# Altium schematic sheet MezzanineConnectors.SchDoc
size 420 x 297 mm; DocumentNumber: 6; SheetNumber: 5; SheetTotal: 6; PageSetup: Record=PageOptions|CenterHorizontal=True|CenterVertical=True|PrintScale=0.96|XCorrection=1.00|YCorrection=1.00|PrintKind=1|BorderSize=5000000|LeftOffset=0|BottomOffset=0|Orientation=2|PaperLength=4318|PaperWidth=2794|Scale=100|PaperSource=7|PrintQuality=600|MediaType=1|DitherType=10|PaperKind=11" x 17"|PrintScaleMode=1
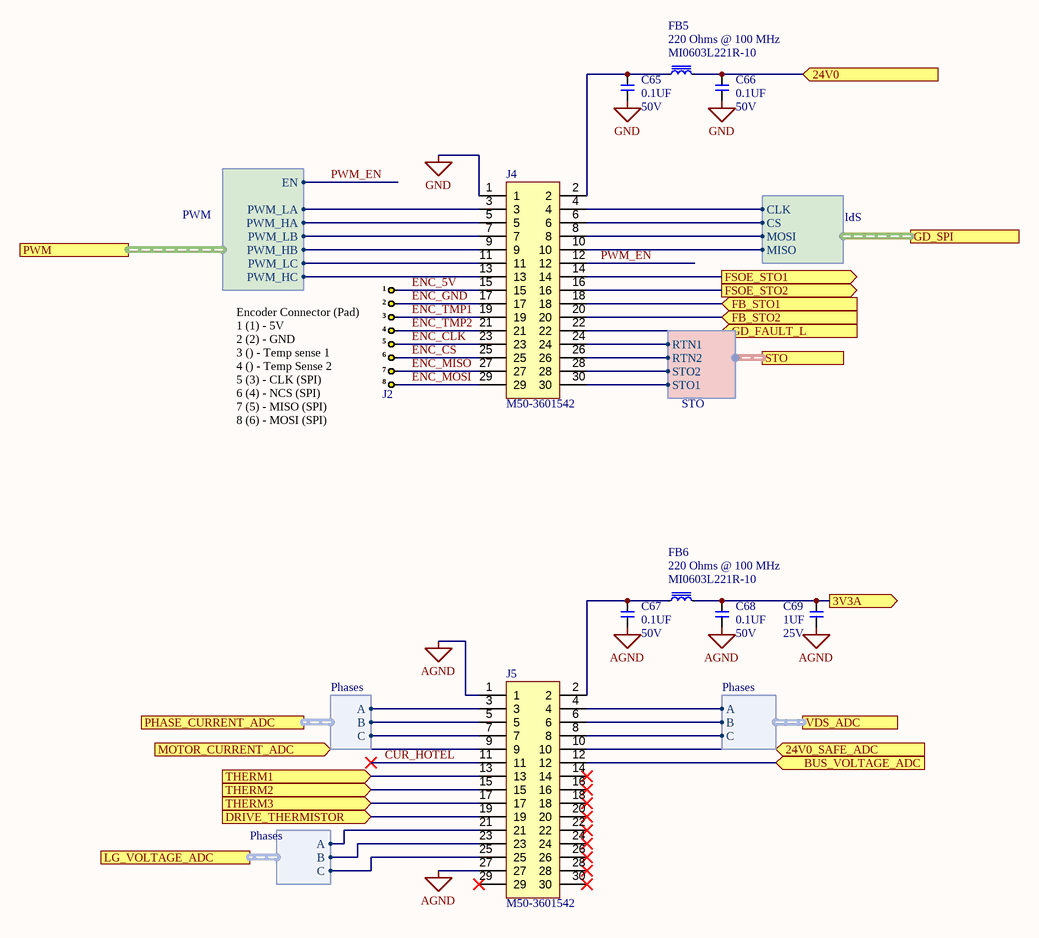
[diagram p0: MezzanineConnectors.SchDoc]

## Parts
C65  value 0.1UF  Voltage: 50V  [C0402]  (hidden comment: __Template_Cap)
C66  value 0.1UF  Voltage: 50V  [C0402]  (hidden comment: __Template_Cap)
C67  value 0.1UF  Voltage: 50V  [C0402]  (hidden comment: __Template_Cap)
C68  value 0.1UF  Voltage: 50V  [C0402]  (hidden comment: __Template_Cap)
C69  value 1UF  Voltage: 25V  [C0402]  (hidden comment: __Template_Cap)
FB5  value 220 Ohms @ 100 MHz  Manufacturer Part Number: MI0603L221R-10  [INDC160X80X105L30N]  (hidden comment: LAIRD MI0603L221R-10)
FB6  value 220 Ohms @ 100 MHz  Manufacturer Part Number: MI0603L221R-10  [INDC160X80X105L30N]  (hidden comment: LAIRD MI0603L221R-10)
J2  DIRECT_SOLDER_8_PIN  [8_PIN_DIRECT_25mil_1.5mm]  (value not drawn)  (no BOM)
J4  MFG P/N: M50-3601542  [HARWIN_M50-3601542]
J5  MFG P/N: M50-3601542  [HARWIN_M50-3601542]

## Ports
3V3A (out), 24V0 (in), 24V0_SAFE_ADC (in), BUS_VOLTAGE_ADC (in), DRIVE_THERMISTOR (in), FB_STO1 (in), FB_STO2 (in), FSOE_STO1 (out), FSOE_STO2 (out), GD_FAULT_L (in), GD_SPI (harness SPI), LG_VOLTAGE_ADC (harness Phases), MOTOR_CURRENT_ADC (in), PHASE_CURRENT_ADC (harness Phases), PWM (harness PWM), STO (harness STO), THERM1 (in), THERM2 (in), THERM3 (in), VDS_ADC (harness Phases)

## Harnesses
PWM: EN, PWM_HA, PWM_LA, PWM_HB, PWM_LB, PWM_HC, PWM_LC
SPI: CLK, CS, MOSI, MISO
Phases: A, B, C
STO: RTN1, RTN2, STO1, STO2

## Nets
AGND: C67.2 C68.2 C69.2 J5.1 J5.27
GND: C65.2 C66.2 J4.1
3V3A: C68.1 C69.1 FB6.2 ; port 3V3A
24V0: C66.1 FB5.2 ; port 24V0
24V0_SAFE_ADC: J5.10 ; port 24V0_SAFE_ADC
BUS_VOLTAGE_ADC: J5.12 ; port BUS_VOLTAGE_ADC
CUR_HOTEL: J5.11
DRIVE_THERMISTOR: J5.19 ; port DRIVE_THERMISTOR
ENC_5V: J2.1 J4.15
ENC_CLK: J2.5 J4.23
ENC_CS: J2.6 J4.25
ENC_GND: J2.2 J4.17
ENC_MISO: J2.7 J4.27
ENC_MOSI: J2.8 J4.29
ENC_TMP1: J2.3 J4.19
ENC_TMP2: J2.4 J4.21
FB_STO1: J4.18 ; port FB_STO1
FB_STO2: J4.20 ; port FB_STO2
FSOE_STO1: J4.14 ; port FSOE_STO1
FSOE_STO2: J4.16 ; port FSOE_STO2
GD_FAULT_L: J4.22 ; port GD_FAULT_L
MOTOR_CURRENT_ADC: J5.9 ; port MOTOR_CURRENT_ADC
PWM_EN: J4.12 ; port PWM.EN
THERM1: J5.13 ; port THERM1
THERM2: J5.15 ; port THERM2
THERM3: J5.17 ; port THERM3
NetC65_1: C65.1 FB5.1 J4.2
NetC67_1: C67.1 FB6.1 J5.2
NetJ4_3: J4.3 ; port PWM.PWM_LA
NetJ4_4: J4.4 ; port GD_SPI.CLK
NetJ4_5: J4.5 ; port PWM.PWM_HA
NetJ4_6: J4.6 ; port GD_SPI.CS
NetJ4_7: J4.7 ; port PWM.PWM_LB
NetJ4_8: J4.8 ; port GD_SPI.MOSI
NetJ4_9: J4.9 ; port PWM.PWM_HB
NetJ4_10: J4.10 ; port GD_SPI.MISO
NetJ4_11: J4.11 ; port PWM.PWM_LC
NetJ4_13: J4.13 ; port PWM.PWM_HC
NetJ4_24: J4.24 ; port STO.RTN1
NetJ4_26: J4.26 ; port STO.RTN2
NetJ4_28: J4.28 ; port STO.STO2
NetJ4_30: J4.30 ; port STO.STO1
NetJ5_3: J5.3 ; port PHASE_CURRENT_ADC.A
NetJ5_4: J5.4 ; port VDS_ADC.A
NetJ5_5: J5.5 ; port PHASE_CURRENT_ADC.B
NetJ5_6: J5.6 ; port VDS_ADC.B
NetJ5_7: J5.7 ; port PHASE_CURRENT_ADC.C
NetJ5_8: J5.8 ; port VDS_ADC.C
NetJ5_21: J5.21 ; port LG_VOLTAGE_ADC.A
NetJ5_23: J5.23 ; port LG_VOLTAGE_ADC.B
NetJ5_25: J5.25 ; port LG_VOLTAGE_ADC.C

Not connected (* = marked no-connect by the designer): J5 14* 16* 18* 20* 22* 24* 26* 28* 29* 30*

## Notes on the sheet
- (near J2) Encoder Connector (Pad)
  1 (1) - 5V
  2 (2) - GND
  3 () - Temp sense 1
  4 () - Temp Sense 2
  5 (3) - CLK (SPI)
  6 (4) - NCS (SPI)
  7 (5) - MISO (SPI)
  8 (6) - MOSI (SPI)
- CREATIVE COMMONS
- PUBLIC LICENSE:
- BARKOUR ROBOT
- CC BY-NC 4.0
- APPROVED
- DWG NO
- GOOGLE LLC
- FILE
- RELEASED
- 2024/05/09
- SIZE
- 1600 AMPHITHEATRE PARKWAY
- MOUNTAIN VIEW CA 94043
- A3
- SHEET
- OF
- THIS DESIGN IS BEING PROVIDED  FOR NON-COMMERCIAL USE ONLY. THE USE OF =SCIENTIST_NAME_POSSESSIVE NAME IN CONNECTION WITH THE DESIGN IS NOT INTENDED TO IMPLY THAT =SCIENTIST_NAME SPONSORS OR ENDORSES THE DESIGN, GOOGLE LLC, OR ANY OF GOOGLE LLC'S PRODUCTS OR SERVICES.

## Library data of the parts
C65-C68 = 1762: CAP, CER, X5R, 0.1uF, 10%, 50V, 0402, 0.55mm; ID: 1762; MFG: YAGEO; MFG P/N: CC0402KRX5R9BB104; EPIC: G150-02449-00; EES: 150-04581-00; Status: Released; Package: 0402; Dielectric: X5R; Tolerance: 10%; Height: 0.55mm; Supplier 1: Digi-Key; HelpURL: https://www.digikey.com/product-detail/en/yageo/CC0402KRX5R9BB104/311-3342-1-ND/6818312; ComponentLink1Description: Datasheet; ComponentLink1URL: http://www.yageo.com/documents/recent/UPY-GPHC_X5R_4V-to-50V_25.pdf; Supplier Part Number 1: 311-3342-1-ND
C69 = 1717: CAP, CER, X5R, 1uF, 10%, 25V, 0402; ID: 1717; MFG: TDK; MFG P/N: C1005X5R1E105K050BC; COMMON: 150-01202-00; PROXY: 150-03358-00; EES: 150-04580-00; Status: Released; Package: 0402; Dielectric: X5R; Tolerance: 10%; Height: 0.56mm; Supplier 1: Digi-Key; HelpURL: https://www.digikey.in/product-detail/en/tdk-corporation/C1005X5R1E105K050BC/445-9066-1-ND/3648637; ComponentLink1Description: Datasheet; ComponentLink1URL: https://product.tdk.com/info/en/catalog/datasheets/mlcc_commercial_general_en.pdf; Supplier Part Number 1: 445-9066-1-ND
FB5 FB6 = f5bd4cf1-070f-4480-bf1a-f8cba0e78574: FERRITE BEAD 220 OHM 0603 1LN; Manufacturer: Laird Technologies; Grade: Commercial; Current Rating: 2A; ComponentId: f5bd4cf1-070f-4480-bf1a-f8cba0e78574; Package: Inductor, 0603; ComponentLink1Description: Datasheet; ComponentLink1URL: https://media.digikey.com/pdf/Data%20Sheets/Laird%20Technologies/EMI_Filtering_and_RF_Inductors.pdf; Category: Ferrite Beads; Status: Preliminary; Storage Temperature: -40 °C ~ 125 °C; Operating Temperature: -40 °C ~ 125 °C
J4 J5 = 1207: CONN, HDR, UNSHRD, VERT, 2x15 P, 1.27MM PITCH, 5.33MM H, GOLD, SMD; ID: 1207; MFG: Harwin Inc.; Connector Type: Header; Number of Positions: 30; Gender: Male; Current Rating: 1A; EES: 210-04985-00; Sub Assy Qty 2: 0; Status: Released; RoHS Compliant: Yes; Mounting Type: Surface Mount; Orientation: Vertical; Pitch: 1.27mm; Number of Rows: 2; Row Spacing: 1.27mm; Operating Temperature: -40°C ~ 105°C; Supplier 1: Digi-Key; HelpURL: https://www.digikey.com/en/products/detail/harwin-inc/M50-3601542/2762094; ComponentLink1Description: Datasheet; ComponentLink1URL: https://cdn.harwin.com/pdfs/M50-360.pdf; Height: 5.33mm; Supplier Part Number 1: 952-1695-ND; Sub Assy Qty 3: 0; Sub Assy Qty 4: 0